# Altium schematic sheet Ethernet.SchDoc: Iris
size A3; Organization: Toradex AG; Address1: Altsagenstrasse 5; Address2: Horw; Address3: 6048; Address4: Switzerland; DocumentNumber: 5; Revision: V2.0; SheetNumber: 5; SheetTotal: 16
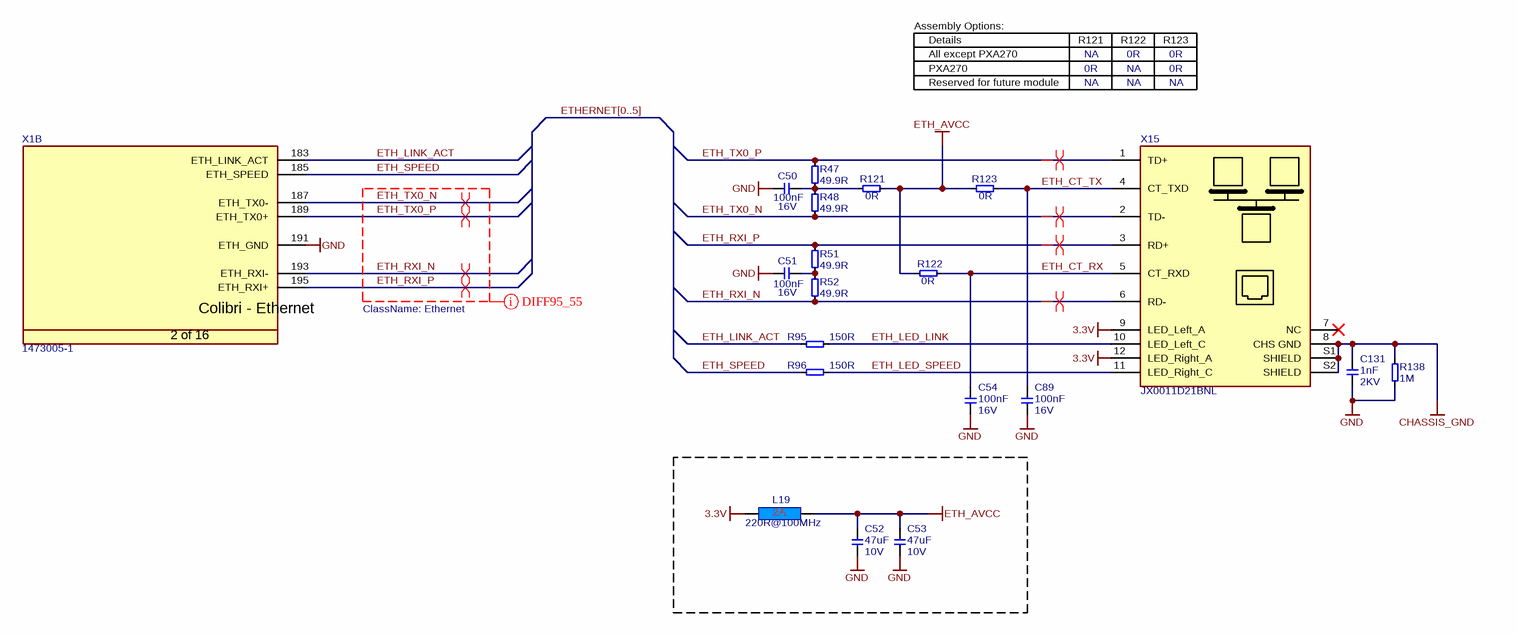
[diagram p0: Ethernet.SchDoc]

## Parts
C50  Rating: 16V  [CAPC1005X60N]  (hidden comment: 100nF)
C51  Rating: 16V  [CAPC1005X60N]  (hidden comment: 100nF)
C52  Rating: 10V  [T_CAPC0805X125N]  (hidden comment: 47uF)
C53  Rating: 10V  [T_CAPC0805X125N]  (hidden comment: 47uF)
C54  Rating: 16V  [CAPC1005X60N]  (hidden comment: 100nF)
C89  Rating: 16V  [CAPC1005X60N]  (hidden comment: 100nF)
C131  Rating: 2KV  [T_CAPC1206X180N]  (hidden comment: 1nF)
L19  220R@100MHz  [INDC1608X95N]
R47  49.9R  [RESC1005X40N]
R48  49.9R  [RESC1005X40N]
R51  49.9R  [RESC1005X40N]
R52  49.9R  [RESC1005X40N]
R95  150R  [RESC1005X40N]
R96  150R  [RESC1005X40N]
R121  0R  [T_RESC0603X30N]
R122  0R  [T_RESC0603X30N]
R123  0R  [T_RESC0603X30N]
R138  1M  [T_RESC0603X30N]
X1  1473005-1  [T_Tyco_1473005-1]  (part B of 16)
X15  JX0011D21BNL  [T_Pulse_J00-0065NL]

## Nets
3.3V: L19.1 X15.9(LED_Left_A) X15.12(LED_Right_A)
CHASSIS_GND: C131.2 R138.2 X15.8(CHS_GND) X15.S1(SHIELD) X15.S2(SHIELD)
ETH_AVCC: C52.1 C53.1 L19.2 R121.2 R122.1 R123.1
GND: C50.1 C51.1 C52.2 C53.2 C54.1 C89.1 C131.1 R138.1 X1.191(ETH_GND)
ETH_CT_RX: C54.2 R122.2 X15.5(CT_RXD)
ETH_CT_TX: C89.2 R123.2 X15.4(CT_TXD)
ETH_LED_LINK: R95.2 X15.10(LED_Left_C)
ETH_LED_SPEED: R96.2 X15.11(LED_Right_C)
ETH_LINK_ACT: R95.1 X1.183(ETH_LINK_ACT)
ETH_RXI_N: R52.1 X1.193(ETH_RXI-) X15.6(RD-)
ETH_RXI_P: R51.2 X1.195(ETH_RXI+) X15.3(RD+)
ETH_SPEED: R96.1 X1.185(ETH_SPEED)
ETH_TX0_N: R48.1 X1.187(ETH_TX0-) X15.2(TD-)
ETH_TX0_P: R47.2 X1.189(ETH_TX0+) X15.1(TD+)
NetC50_2: C50.2 R47.1 R48.2 R121.1
NetC51_2: C51.2 R51.1 R52.2

Not connected (* = marked no-connect by the designer): X15 7(NC)*

## Buses and harness runs
bus ETHERNET[0..5]

## Layout directives
differential pair: ETH_RXI_N, ETH_RXI_P, ETH_TX0_N, ETH_TX0_P
net class Ethernet: ETH_RXI_N, ETH_RXI_P, ETH_TX0_N, ETH_TX0_P

## Notes on the sheet
- Assembly Options:
- All except PXA270
- PXA270
- Reserved for future module
- Details
- R121
- NA
- 0R
- R122
- R123
- Title
- Size:
- Date:
- A3
- Number:
- Time:
- Revision:
- Sheet
- of
- File:
- (in symbol CON-Tyco-1473005-1-200-0.6mm, part B) Colibri - Ethernet; 2 of 16

## Library data of the parts
C50 C51 C54 C89 = C-X7R-100nF-16V-10%-0402: Capacitor Ceramic X7R 100nF 16V 10% 0402; Tolerance: 10%; Type: X7R; Value: 100nF
C52 C53 = C-X5R-47uF-10V-20%-0805: Capacitor Ceramic X5R 47uF 10V 20% 0805; Tolerance: 20%; Type: X5R; Value: 47uF
C131 = C-X7R-1nF-2KV-10%-1206: Capacitor Ceramic X7R 1nF 2KV 10% 1206; Tolerance: 10%; Type: X7R; Value: 1nF
L19 = L-220R@100MHz-2A-25%-0603: 220R@100MHz 2A EMI FILTER; Tolerance: 25%; Rating: 2A; Value: 220R@100MHz
R47 R48 R51 R52 = R-49.9R-100mW-1%-0402: Resistor 49.9 ohm 100mW 1% 0402; Rating: 100mW; Tolerance: 1%; Value: 49.9R; Size: 0402
R95 R96 = R-150R-63mW-5%-0402: Resistor 150 ohm 63mW 5% 0402; Tolerance: 5%; Value: 150R; Rating: 63mW
R121-R123 = R-0R-63mW-5%-0603: Resistor 0 ohm 63mW 5% 0603; Rating: 63mW; Tolerance: 5%; Value: 0R; Size: 0603 (In)
R138 = R-1MR-63mW-5%-0603: Resistor 1 Mohm 63mW 5% 0603; Value: 1MR; Rating: 63mW; Tolerance: 5%
X1 = CON-Tyco-1473005-1-200-0.6mm: SODIMM Connector; Manufacturer Name: Tyco; No. of ways: 200; Manufacturer Part No.: 1473005-1
X15 = CON-Pulse-JX0011D21BNL: RJ45 connector with magentics, 10/100 Base-TX, AutoMDIX, Through Hole; Manufacturer Name: Pulse; No. of ways: 12; Manufacturer Part No.: JX0011D21BNL